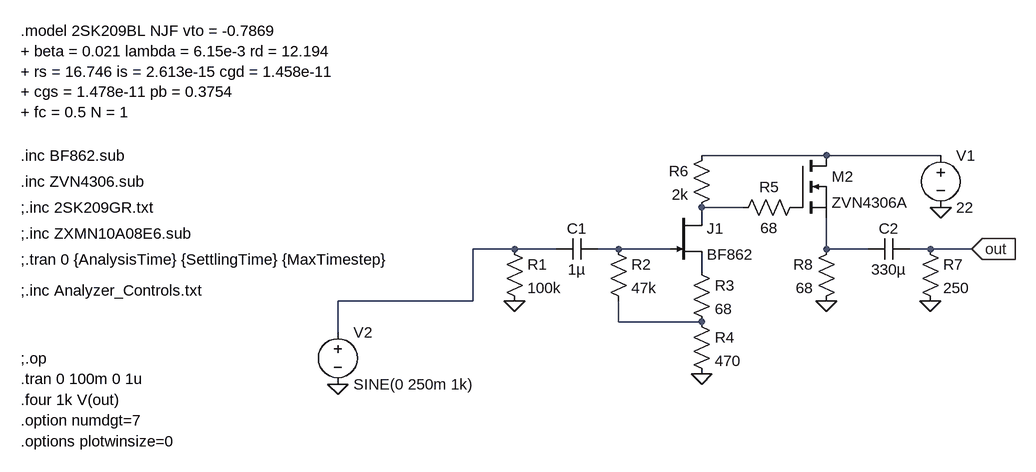
[diagram p0: schematic Example_BJT_THD_TEST.asc]
Example_BJT_THD_TEST.asc, the LTspice schematic file:
Version 4
SHEET 1 5108 4212
WIRE 448 -288 256 -288
WIRE 624 -288 448 -288
WIRE 320 -208 256 -208
WIRE -32 -144 -96 -144
WIRE 32 -144 -32 -144
WIRE 128 -144 96 -144
WIRE 208 -144 128 -144
WIRE 448 -144 448 -192
WIRE 512 -144 448 -144
WIRE 608 -144 576 -144
WIRE 672 -144 608 -144
WIRE -96 -64 -96 -144
WIRE -96 -64 -304 -64
WIRE 128 -32 128 -64
WIRE 256 -32 128 -32
WIRE -304 -16 -304 -64
FLAG -32 -64 0
FLAG 256 48 0
FLAG 624 -208 0
FLAG 448 -64 0
FLAG 608 -64 0
FLAG 672 -144 out
IOPIN 672 -144 In
FLAG -304 64 0
SYMBOL voltage 624 -304 R0
WINDOW 123 0 0 Left 0
WINDOW 39 0 0 Left 0
SYMATTR InstName V1
SYMATTR Value 22
SYMBOL njf 208 -208 R0
SYMATTR InstName J1
SYMATTR Value BF862
SYMATTR SpiceModel BF862
SYMATTR Prefix X
SYMBOL cap 96 -160 R90
WINDOW 0 0 32 VBottom 2
WINDOW 3 32 32 VTop 2
SYMATTR InstName C1
SYMATTR Value 1µ
SYMBOL res -48 -160 R0
SYMATTR InstName R1
SYMATTR Value 100k
SYMBOL res 112 -160 R0
SYMATTR InstName R2
SYMATTR Value 47k
SYMBOL res 240 -128 R0
SYMATTR InstName R3
SYMATTR Value 68
SYMBOL res 240 -48 R0
SYMATTR InstName R4
SYMATTR Value 470
SYMBOL res 416 -224 R90
WINDOW 0 0 56 VBottom 2
WINDOW 3 32 56 VTop 2
SYMATTR InstName R5
SYMATTR Value 68
SYMBOL cap 576 -160 R90
WINDOW 0 0 32 VBottom 2
WINDOW 3 32 32 VTop 2
SYMATTR InstName C2
SYMATTR Value 330µ
SYMBOL res 592 -160 R0
SYMATTR InstName R7
SYMATTR Value 250
SYMBOL res 464 -160 M0
SYMATTR InstName R8
SYMATTR Value 68
SYMBOL nmos 400 -288 R0
SYMATTR InstName M2
SYMATTR Value ZVN4306A
SYMATTR Prefix X
SYMATTR SpiceModel ZVN4306A
SYMBOL voltage -304 -32 R0
WINDOW 123 0 0 Left 0
WINDOW 39 24 124 Left 2
SYMATTR InstName V2
SYMATTR Value SINE(0 250m 1k)
SYMBOL res 272 -304 M0
SYMATTR InstName R6
SYMATTR Value 2k
TEXT -792 -80 Left 2 !;.inc Analyzer_Controls.txt
TEXT -792 -128 Left 2 !;.tran 0 {AnalysisTime} {SettlingTime} {MaxTimestep}
TEXT -792 -288 Left 2 !.inc BF862.sub
TEXT -792 -248 Left 2 !.inc ZVN4306.sub
TEXT -792 56 Left 2 !.tran 0 100m 0 1u
TEXT -792 88 Left 2 !.four 1k V(out)
TEXT -792 120 Left 2 !.option numdgt=7
TEXT -792 -168 Left 2 !;.inc ZXMN10A08E6.sub
TEXT -792 -208 Left 2 !;.inc 2SK209GR.txt
TEXT -792 -480 Left 2 !.model 2SK209BL NJF vto = -0.7869\n+ beta = 0.021 lambda = 6.15e-3 rd = 12.194\n+ rs = 16.746 is = 2.613e-15 cgd = 1.458e-11\n+ cgs = 1.478e-11 pb = 0.3754\n+ fc = 0.5 N = 1
TEXT -792 24 Left 2 !;.op
TEXT -792 152 Left 2 !.options plotwinsize=0

The netlist it stands for:
* Example_BJT_THD_TEST.asc
V1 N001 0 22
XJ1 N002 N004 P001 BF862 BF862  ; pins D G S
C1 N004 N003 1µ
R1 N003 0 100k
R2 N004 N006 47k
R3 P001 N006 68
R4 N006 0 470
R5 P002 N002 68
C2 out N005 330µ
R7 out 0 250
R8 N005 0 68
XM2 N001 P002 N005 ZVN4306A ZVN4306A  ; pins D G S
V2 N003 0 SINE(0 250m 1k)
R6 N001 N002 2k
;.inc Analyzer_Controls.txt
;.tran 0 {AnalysisTime} {SettlingTime} {MaxTimestep}
.inc BF862.sub
.inc ZVN4306.sub
.tran 0 100m 0 1u
.four 1k V(out)
.option numdgt=7
;.inc ZXMN10A08E6.sub
;.inc 2SK209GR.txt
.model 2SK209BL NJF vto = -0.7869
+ beta = 0.021 lambda = 6.15e-3 rd = 12.194
+ rs = 16.746 is = 2.613e-15 cgd = 1.458e-11
+ cgs = 1.478e-11 pb = 0.3754
+ fc = 0.5 N = 1
;.op
.options plotwinsize=0
.backanno
.end